# Altium schematic sheet CAN.SchDoc
size A4
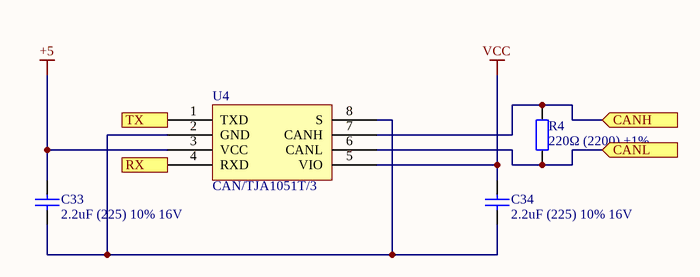
[diagram p0: CAN.SchDoc]

## Parts
C33  2.2uF (225) 10% 16V  [0603_C]
C34  2.2uF (225) 10% 16V  [0603_C]
R4  220Ω (2200) ±1%  [0603_R]
U4  CAN/TJA1051T/3  [SOIC-8_150mil]

## Ports
CANH (in), CANL (in), RX (in), TX (in)

## Nets
+5: C33.2 U4.3(VCC)
VCC: C34.2 U4.5(VIO)
CANH: R4.2 U4.7(CANH) ; port CANH
CANL: R4.1 U4.6(CANL) ; port CANL
RX: U4.4(RXD) ; port RX
TX: U4.1(TXD) ; port TX
NetC33_1: C33.1 C34.1 U4.2(GND) U4.8(S)

## Library data of the parts
C33 C34 = 0603 2.2uF (225) 10% 16V: 贴片电容; ComponentLink1Description: 供应商链接; ComponentLink1URL: http://www.szlcsc.com/product/details_24366.html; Package: 0603; Supplier: LC; SuppliersPartNumber: C23630
R4 = 0603 220Ω (2200) 1%: 贴片电阻; ComponentLink1Description: 供应商链接; ComponentLink1URL: http://www.szlcsc.com/product/details_23689.html; Package: 0603; Supplier: LC; SuppliersPartNumber: C22962
U4 = CAN/TJA1051T/3_[C38695]: CAN; ComponentLink1Description: 供应商链接; ComponentLink1URL: http://www.szlcsc.com/product/details_39678.html; Package: SOIC-8_150mil; Supplier: LC; SuppliersPartNumber: C38695